# Altium schematic sheet DigitalIO.SchDoc: xcore.ai Multi Channel Audio
size 408 x 287 mm; DocumentNumber: 5; Revision: 1V1; SheetNumber: 5; SheetTotal: 8
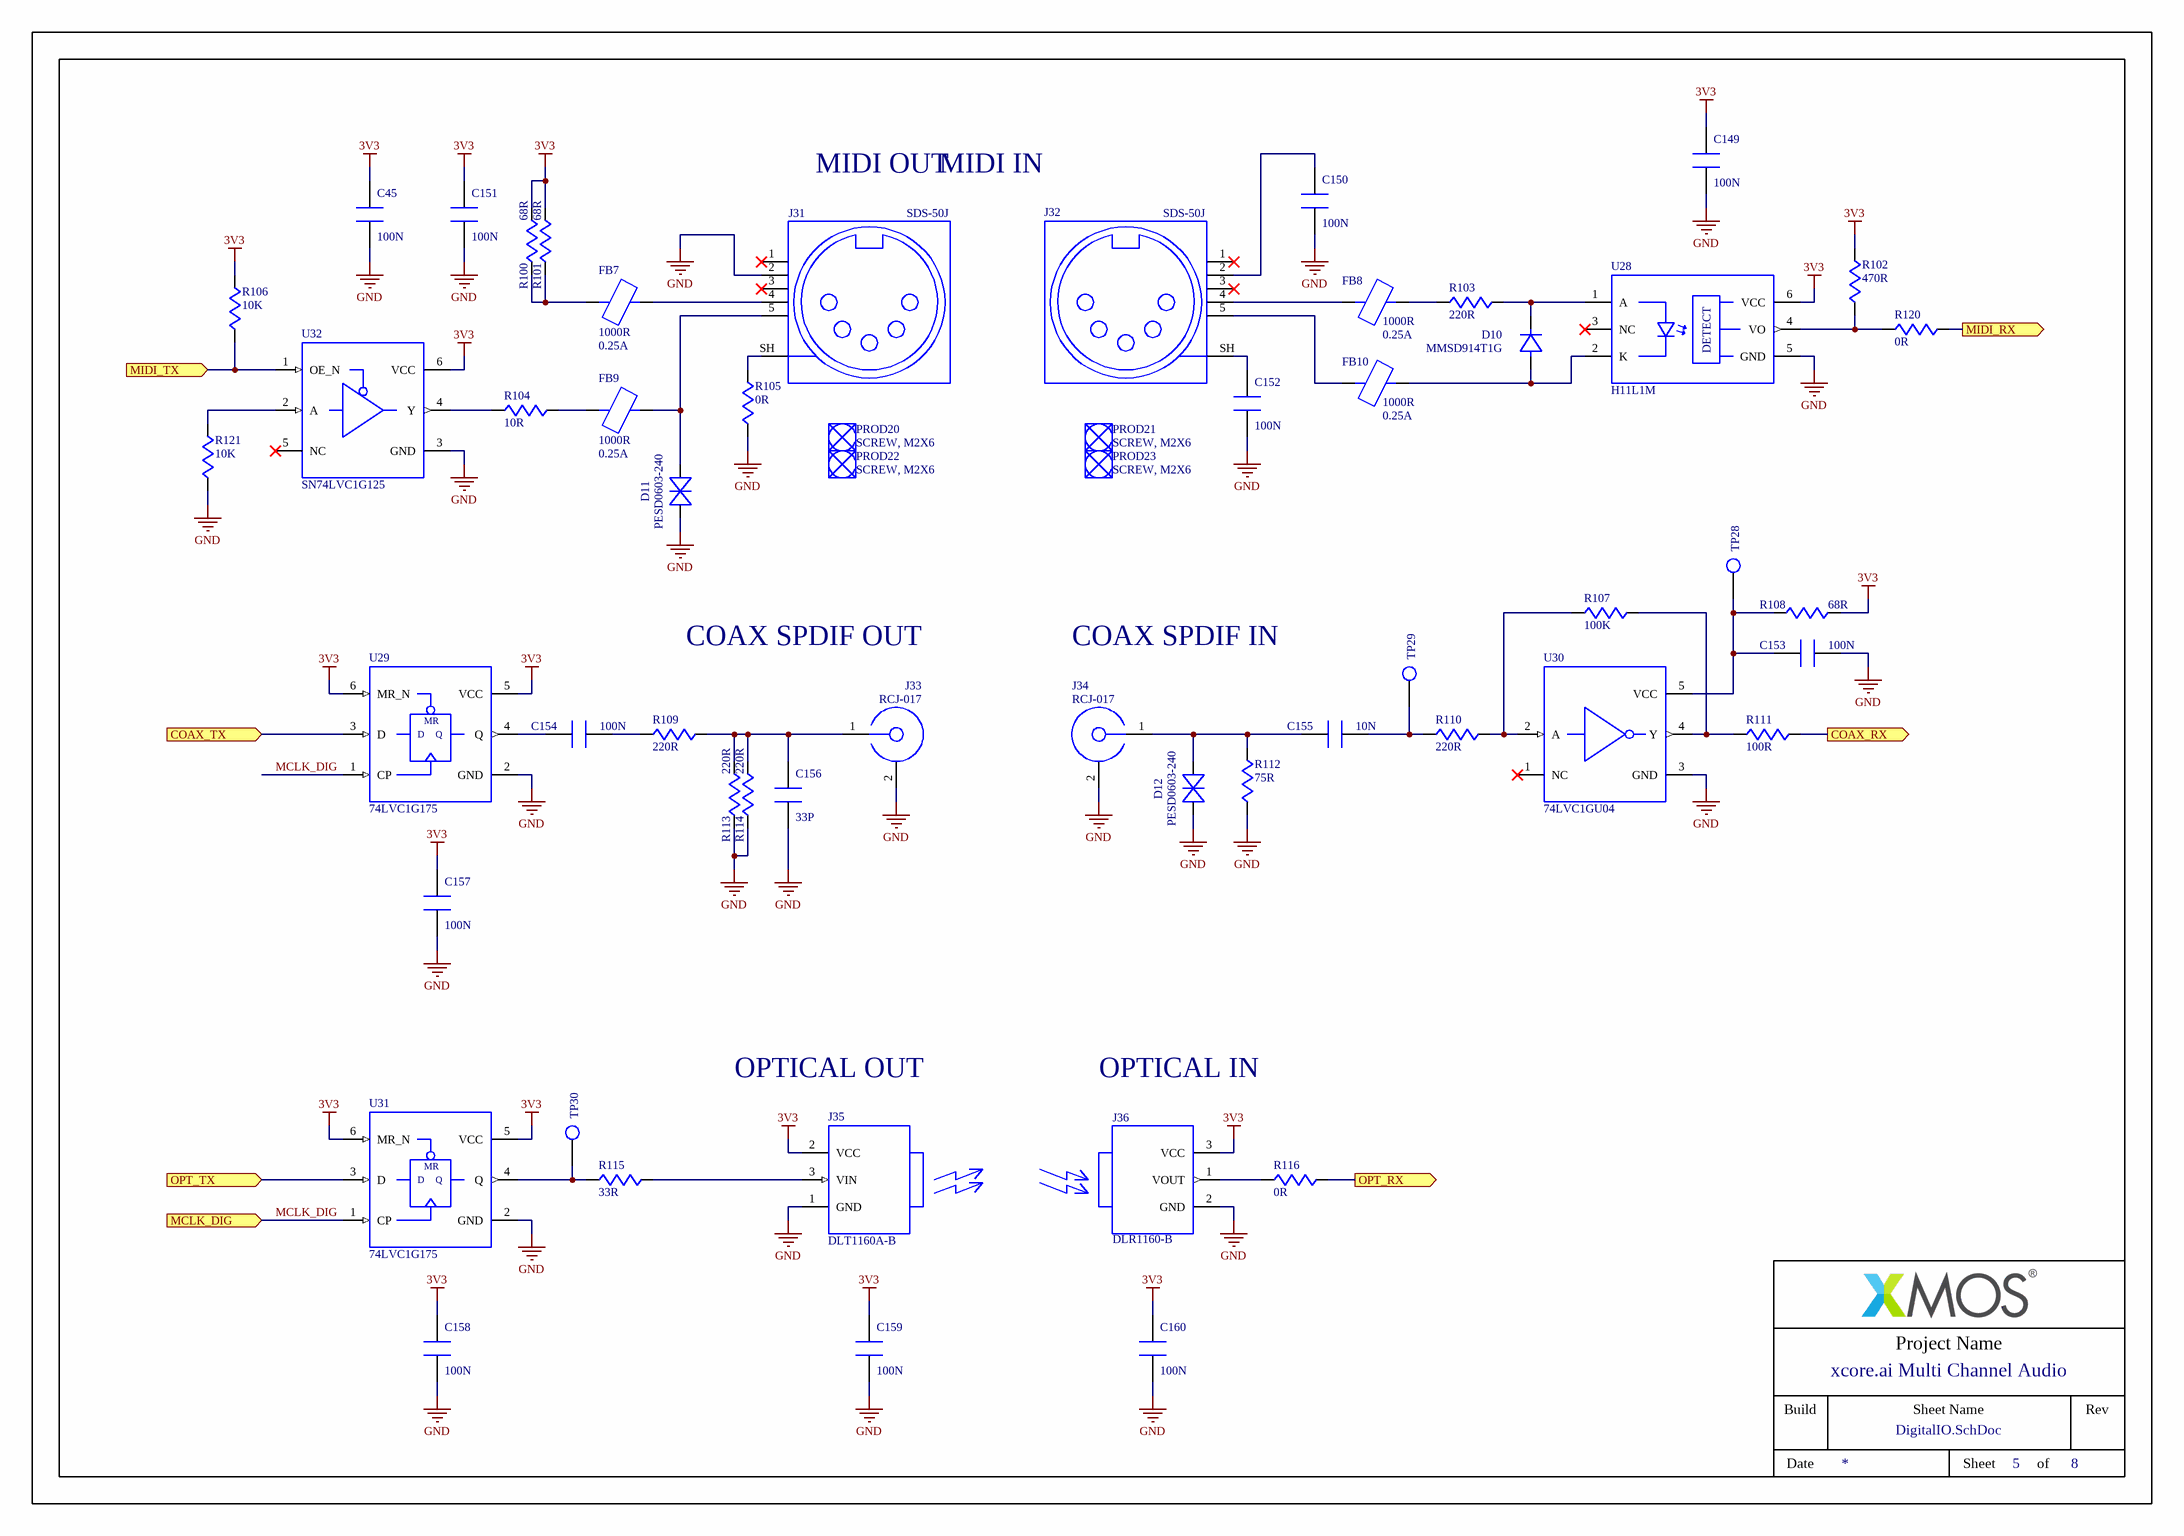
[diagram p0: DigitalIO.SchDoc]

## Parts
C45  100N  [CAPC1005X55N]
C149  100N  [CAPC1005X55N]
C150  100N  [CAPC1608X90N]
C151  100N  [CAPC1005X55N]
C152  100N  [CAPC1608X90N]
C153  100N  [CAPC1005X55N]
C154  100N  [CAPC1005X55N]
C155  10N  [CAPC1005X55N]
C156  33P  [CAPC1005X55N]
C157  100N  [CAPC1005X55N]
C158  100N  [CAPC1005X55N]
C159  100N  [CAPC1005X55N]
C160  100N  [CAPC1005X55N]
D10  MMSD914T1G  [SOD3716X135N]
D11  PESD0603-240  [RESC1608X55N]
D12  PESD0603-240  [RESC1608X55N]
FB7  1000R  Rated Current: 0.25A  [INDC1005X55N]
FB8  1000R  Rated Current: 0.25A  [INDC1005X55N]
FB9  1000R  Rated Current: 0.25A  [INDC1005X55N]
FB10  1000R  Rated Current: 0.25A  [INDC1005X55N]
J31  SDS-50J  [DIN_5PIN_180_RA]
J32  SDS-50J  [DIN_5PIN_180_RA]
J33  RCJ-017  [CON_CUI_RCJ_017]
J34  RCJ-017  [CON_CUI_RCJ_017]
J35  DLT1160A-B  [CON_OPT_AIXIN_DLX1160]
J36  DLR1160-B  [CON_OPT_AIXIN_DLX1160]
PROD20  SCREW, M2X6  (mechanical)
PROD21  SCREW, M2X6  (mechanical)
PROD22  SCREW, M2X6  (mechanical)
PROD23  SCREW, M2X6  (mechanical)
R100  68R  [RESC3116X65N]
R101  68R  [RESC3116X65N]
R102  470R  [RESC1608X55N]
R103  220R  [RESC3116X65N]
R104  10R  [RESC3116X65N]
R105  0R  [RESC1608X55N]
R106  10K  [RESC1608X55N]
R107  100K  [RESC1608X55N]
R108  68R  [RESC1608X55N]
R109  220R  [RESC1608X55N]
R110  220R  [RESC1608X55N]
R111  100R  [RESC1608X55N]
R112  75R  [RESC3116X65N]
R113  220R  [RESC1608X55N]
R114  220R  [RESC1608X55N]
R115  33R  [RESC1608X55N]
R116  0R  [RESC1608X55N]
R120  0R  [RESC1608X55N]
R121  10K  [RESC1608X55N]
TP28  TESTPOINT  [TESTPOINT_SMD_1MM]  (value not drawn)  (no BOM)
TP29  TESTPOINT  [TESTPOINT_SMD_1MM]  (value not drawn)  (no BOM)
TP30  TESTPOINT  [TESTPOINT_SMD_1MM]  (value not drawn)  (no BOM)
U28  H11L1M  [IC_ONSEMI_PDIP6_646BY]
U29  74LVC1G175  [SOT95P280X145-6N]
U30  74LVC1GU04  [SOT23-5P95_275X110L40X37N]
U31  74LVC1G175  [SOT95P280X145-6N]
U32  SN74LVC1G125  [TI_R_PUSON_N6]

## Ports
COAX_RX (out), COAX_TX (in), MCLK_DIG (in), MIDI_RX (out), MIDI_TX (in), OPT_RX (out), OPT_TX (in)

## Nets
3V3: C45.1 C149.1 C151.1 C157.1 C158.1 C159.1 C160.1 J35.2(VCC) J36.3(VCC) R100.2 R101.2 R102.2 R106.2 R108.1 U28.6(VCC) U29.5(VCC) U29.6(MR_N) U31.5(VCC) U31.6(MR_N) U32.6(VCC)
GND: C45.2 C149.2 C150.2 C151.2 C152.2 C153.2 C156.2 C157.2 C158.2 C159.2 C160.2 D11.1 D12.1 J31.2 J33.2 J34.2 J35.1(GND) J36.2(GND) R105.1 R112.1 R113.1 R114.1 R121.1 U28.5(GND) U29.2(GND) U30.3(GND) U31.2(GND) U32.3(GND)
COAX_RX: R111.2 ; port COAX_RX
COAX_TX: U29.3(D) ; port COAX_TX
MCLK_DIG: U29.1(CP) U31.1(CP) ; port MCLK_DIG
MIDI_RX: R120.2 ; port MIDI_RX
MIDI_TX: R106.1 U32.1(OE_N) ; port MIDI_TX
OPT_RX: R116.2 ; port OPT_RX
OPT_TX: U31.3(D) ; port OPT_TX
NetC150_1: C150.1 J32.2
NetC152_1: C152.1 J32.SH(SHIELD)
NetC153_1: C153.1 R108.2 TP28.1 U30.5(VCC)
NetC154_1: C154.1 U29.4(Q)
NetC154_2: C154.2 R109.1
NetC155_1: C155.1 D12.2 J34.1 R112.2
NetC155_2: C155.2 R110.1 TP29.1
NetC156_1: C156.1 J33.1 R109.2 R113.2 R114.2
NetD10_1: D10.1(K) R103.2 U28.1(A)
NetD10_2: D10.2(A) FB10.2 U28.2(K)
NetD11_2: D11.2 FB9.1 J31.5
NetFB7_1: FB7.1 J31.4
NetFB7_2: FB7.2 R100.1 R101.1
NetFB8_1: FB8.1 J32.4
NetFB8_2: FB8.2 R103.1
NetFB9_2: FB9.2 R104.2
NetFB10_1: FB10.1 J32.5
NetJ31_SH: J31.SH(SHIELD) R105.2
NetJ35_3: J35.3(VIN) R115.2
NetJ36_1: J36.1(VOUT) R116.1
NetR102_1: R102.1 R120.1 U28.4(VO)
NetR104_1: R104.1 U32.4(Y)
NetR107_1: R107.1 R110.2 U30.2(A)
NetR107_2: R107.2 R111.1 U30.4(Y)
NetR115_1: R115.1 TP30.1 U31.4(Q)
NetR121_2: R121.2 U32.2(A)

Not connected (* = marked no-connect by the designer): J31 1* 3*; J32 1* 3*; U28 3(NC)*; U30 1(NC)*; U32 5(NC)*

## Notes on the sheet
- MIDI OUT
- MIDI IN
- COAX SPDIF OUT
- COAX SPDIF IN
- OPTICAL OUT
- OPTICAL IN
- Project Name
- Build
- Sheet Name
- Rev
- Date
- Sheet
- of
- (in symbol GEN-11-0051) MR
- (in symbol GEN-13-0028) DETECT

## Library data of the parts
C45 C149 C151 C153 C154 C157-C160 = STD-06-0048: CHIP CAPACITOR, CERAMIC, 100NF, 16V, 10%, X7R, 0402; Manufacturer: Yageo; Manufacturer Part Number: CC0402KRX7R7BB104; Approx Volume Cost ($): 0.003; VALUE: 100N; Part Number: STD-06-0048; Dielectric: X7R; Rated Voltage: 16V; Tolerance: 10%; Web Search Link: http://www.google.com/search?q=CC0402KRX7R7BB104
C150 C152 = STD-06-0073: CHIP CAPACITOR, CERAMIC, 100NF, 50V, 10%, X7R, 0603; Manufacturer: Yageo; Manufacturer Part Number: CC0603KRX7R9BB104; Approx Volume Cost ($): 0.002; VALUE: 100N; Part Number: STD-06-0073; Dielectric: X7R; Rated Voltage: 50V; Tolerance: 10%; Web Search Link: http://www.google.com/search?q=CC0603KRX7R9BB104
C155 = STD-06-0042: CHIP CAPACITOR, CERAMIC, 10NF, 50V, 10%, X7R, 0402; Manufacturer: Yageo; Manufacturer Part Number: CC0402KRX7R9BB103; Approx Volume Cost ($): 0.002; VALUE: 10N; Part Number: STD-06-0042; Dielectric: X7R; Rated Voltage: 50V; Tolerance: 10%; Web Search Link: http://www.google.com/search?q=CC0402KRX7R9BB103
C156 = STD-06-0019: CHIP CAPACITOR, CERAMIC, 33PF, 50V, 5%, NP0, 0402; Manufacturer: Yageo; Manufacturer Part Number: CC0402JRNPO9BN330; Approx Volume Cost ($): 0.003; VALUE: 33P; Part Number: STD-06-0019; Dielectric: NP0; Rated Voltage: 50V; Tolerance: 5%; Web Search Link: http://www.google.com/search?q=CC0402JRNPO9BN330
D10 = GEN-16-0055: Diode, 100V, 0.2A, SOD123; Manufacturer: ON Semiconductor; Approx Volume Cost ($): 0.04; VALUE: MMSD914T1G; Part Number: GEN-16-0055; Manufacturer Part Number: MMSD914T1G; Web Search Link: http://www.google.com/search?q=MMSD914T1G
D11 D12 = GEN-16-0011: Polymer ESD Protection Device, 24V Stand-Off, 0.25pF, 0603; Manufacturer: Tyco; Approx Volume Cost ($): 0.12; VALUE: PESD0603-240; Part Number: GEN-16-0011; Manufacturer Part Number: PESD0603-240; Web Search Link: http://www.google.com/search?q=PESD0603-240
FB7-FB10 = GEN-04-0019: Ferrite Bead, 1000R AT 100MHz, For Signal Lines, 0402, 0.25A; Manufacturer: Murata; Manufacturer Part Number: BLM15HD102SN1; Max DCR: 1.25R; Approx Volume Cost ($): 0.018; VALUE: 1000R; Part Number: GEN-04-0019; Web Search Link: http://www.google.com/search?q=BLM15HD102SN1
J31 J32 = GEN-01-0123: Standard DIN Connector, 5 Pin, 180 degrees, PCB Mount, Right Angle, Through Hole; Manufacturer: CUI; Approx Volume Cost ($): 0.78; VALUE: SDS-50J; Part Number: GEN-01-0123; Manufacturer Part Number: SDS-50J; Web Search Link: http://www.google.com/search?q=SDS-50J
J33 J34 = GEN-01-0124: RCA Jack, Right Angle, Orange, Through Hole; Manufacturer: CUI; Approx Volume Cost ($): 0.47; VALUE: RCJ-017; Part Number: GEN-01-0124; Manufacturer Part Number: RCJ-017; Web Search Link: http://www.google.com/search?q=RCJ-017
J35 = GEN-01-0119: Optical Digital Audio Transmitter, Black Shutter, 16Mbps max, 2.7-5.5V, Through Hole; Manufacturer: Aixin Opto-Electrical Technology; Approx Volume Cost ($): 0.5; VALUE: DLT1160A-B; Part Number: GEN-01-0119; Manufacturer Part Number: DLT1160A-B; Web Search Link: http://www.google.com/search?q=DLT1160A
J36 = GEN-01-0120: Optical Digital Audio Receiver, Black Shutter, 16Mbps max, 2.7-5.5V, Through Hole; Manufacturer: Aixin Opto-Electrical Technology; Approx Volume Cost ($): 0.5; VALUE: DLR1160-B; Part Number: GEN-01-0120; Manufacturer Part Number: DLR1160-B; Web Search Link: http://www.google.com/search?q=DLR1160
PROD20-PROD23 = GEN-23-0012: Machine screw, M2 thread, 6mm length, Steel, BZP, Pan head Pozidriv; Manufacturer: TR Fastenings; Manufacturer Part Number: M2 6 PRSTMC Z100; Approx Volume Cost ($): 0.03; VALUE: SCREW, M2X6; Part Number: GEN-23-0012; Web Search Link: http://www.google.com/search?q=M2 6 PRSTMC Z100
R100 R101 = STD-05-0034: CHIP RESISTOR, 68 OHM, 0.25W, 1%, 1206; Manufacturer: Yageo; Manufacturer Part Number: RC1206FR-0768RL; Max Voltage: 200V; Max Power: 250mW; Temperature Coefficient: ±100ppm/°C; Approx Volume Cost ($): 0.004; VALUE: 68R; Part Number: STD-05-0034; Tolerance: 1%; Web Search Link: http://www.google.com/search?q=RC1206FR-0768RL
R102 = STD-02-0054: CHIP RESISTOR, 470 OHM, 0.1W, 1%, 0603; Manufacturer: Yageo; Manufacturer Part Number: RC0603FR-07470RL; Max Voltage: 50V; Max Power: 100mW; Temperature Coefficient: ±100ppm/°C; Approx Volume Cost ($): 0.002; VALUE: 470R; Part Number: STD-02-0054; Tolerance: 1%; Web Search Link: http://www.google.com/search?q=RC0603FR-07470RL
R103 = STD-05-0046: CHIP RESISTOR, 220 OHM, 0.25W, 1%, 1206; Manufacturer: Yageo; Manufacturer Part Number: RC1206FR-07220RL; Max Voltage: 200V; Max Power: 250mW; Temperature Coefficient: ±100ppm/°C; Approx Volume Cost ($): 0.004; VALUE: 220R; Part Number: STD-05-0046; Tolerance: 1%; Web Search Link: http://www.google.com/search?q=RC1206FR-07220RL
R104 = STD-05-0014: CHIP RESISTOR, 10 OHM, 0.25W, 1%, 1206; Manufacturer: Yageo; Manufacturer Part Number: RC1206FR-0710RL; Max Voltage: 200V; Max Power: 250mW; Temperature Coefficient: ±200ppm/°C; Approx Volume Cost ($): 0.004; VALUE: 10R; Part Number: STD-05-0014; Tolerance: 1%; Web Search Link: http://www.google.com/search?q=RC1206FR-0710RL
R105 R116 R120 = STD-02-0001: CHIP RESISTOR, ZERO OHM JUMPER, 1A, 0603; Manufacturer: Yageo; Manufacturer Part Number: RC0603JR-070RL; Tolerance: NA; Max Voltage: 50V; Approx Volume Cost ($): 0.002; VALUE: 0R; Part Number: STD-02-0001; Max Power: NA; Temperature Coefficient: NA; Web Search Link: http://www.google.com/search?q=RC0603JR-070RL
R106 R121 = STD-02-0086: CHIP RESISTOR, 10K OHM, 0.1W, 1%, 0603; Manufacturer: Yageo; Manufacturer Part Number: RC0603FR-0710KL; Max Voltage: 50V; Max Power: 100mW; Temperature Coefficient: ±100ppm/°C; Approx Volume Cost ($): 0.002; VALUE: 10K; Part Number: STD-02-0086; Tolerance: 1%; Web Search Link: http://www.google.com/search?q=RC0603FR-0710KL
R107 = STD-02-0110: CHIP RESISTOR, 100K OHM, 0.1W, 1%, 0603; Manufacturer: Yageo; Manufacturer Part Number: RC0603FR-07100KL; Max Voltage: 50V; Max Power: 100mW; Temperature Coefficient: ±100ppm/°C; Approx Volume Cost ($): 0.002; VALUE: 100K; Part Number: STD-02-0110; Tolerance: 1%; Web Search Link: http://www.google.com/search?q=RC0603FR-07100KL
R108 = STD-02-0034: CHIP RESISTOR, 68 OHM, 0.1W, 1%, 0603; Manufacturer: Yageo; Manufacturer Part Number: RC0603FR-0768RL; Max Voltage: 50V; Max Power: 100mW; Temperature Coefficient: ±100ppm/°C; Approx Volume Cost ($): 0.002; VALUE: 68R; Part Number: STD-02-0034; Tolerance: 1%; Web Search Link: http://www.google.com/search?q=RC0603FR-0768RL
R109 R110 R113 R114 = STD-02-0046: CHIP RESISTOR, 220 OHM, 0.1W, 1%, 0603; Manufacturer: Yageo; Manufacturer Part Number: RC0603FR-07220RL; Max Voltage: 50V; Max Power: 100mW; Temperature Coefficient: ±100ppm/°C; Approx Volume Cost ($): 0.002; VALUE: 220R; Part Number: STD-02-0046; Tolerance: 1%; Web Search Link: http://www.google.com/search?q=RC0603FR-07220RL
R111 = STD-02-0038: CHIP RESISTOR, 100 OHM, 0.1W, 1%, 0603; Manufacturer: Yageo; Manufacturer Part Number: RC0603FR-07100RL; Max Voltage: 50V; Max Power: 100mW; Temperature Coefficient: ±100ppm/°C; Approx Volume Cost ($): 0.002; VALUE: 100R; Part Number: STD-02-0038; Tolerance: 1%; Web Search Link: http://www.google.com/search?q=RC0603FR-07100RL
R112 = STD-05-0035: CHIP RESISTOR, 75 OHM, 0.25W, 1%, 1206; Manufacturer: Yageo; Manufacturer Part Number: RC1206FR-0775RL; Max Voltage: 200V; Max Power: 250mW; Temperature Coefficient: ±100ppm/°C; Approx Volume Cost ($): 0.004; VALUE: 75R; Part Number: STD-05-0035; Tolerance: 1%; Web Search Link: http://www.google.com/search?q=RC1206FR-0775RL
R115 = STD-02-0026: CHIP RESISTOR, 33 OHM, 0.1W, 1%, 0603; Manufacturer: Yageo; Manufacturer Part Number: RC0603FR-0733RL; Max Voltage: 50V; Max Power: 100mW; Temperature Coefficient: ±100ppm/°C; Approx Volume Cost ($): 0.002; VALUE: 33R; Part Number: STD-02-0026; Tolerance: 1%; Web Search Link: http://www.google.com/search?q=RC0603FR-0733RL
TP28-TP30 = GEN-24-0003: Testpoint, SMD, 1mm; Manufacturer: NA; VALUE: TESTPOINT; Part Number: GEN-24-0003; Manufacturer Part Number: NA; Approx Volume Cost ($): NA
U28 = GEN-13-0028: Optocoupler, Schmitt Trigger Output, 3-15V, 1.6mA Turn-On, PDIP6_SMD; Manufacturer: ON Semiconductor; Manufacturer Part Number: H11L1SM; Approx Volume Cost ($): 0.3; VALUE: H11L1M; Part Number: GEN-13-0028; Web Search Link: http://www.google.com/search?q=H11L1SM
U29 U31 = GEN-11-0051: Single D-Type Flip Flop with Reset, Positive Edge Trigger, LVC Series, SOT23-6 (SC-74); Manufacturer: Nexperia; Manufacturer Part Number: 74LVC1G175GV; Approx Volume Cost ($): 0.1; VALUE: 74LVC1G175; Part Number: GEN-11-0051; Web Search Link: http://www.google.com/search?q=74LVC1G175GV
U30 = GEN-11-0047: Single Unbuffered Inverter, LVC Series, SOT23-5; Manufacturer: Nexperia; Manufacturer Part Number: 74LVC1GU04GV; Approx Volume Cost ($): 0.06; VALUE: 74LVC1GU04; Part Number: GEN-11-0047; Web Search Link: http://www.google.com/search?q=74LVC1GU04GV
U32 = GEN-11-0049: Single Buffer with 3-State Output, LVC Series, SON6; Manufacturer: Texas Instruments; Manufacturer Part Number: SN74LVC1G125DRYR; Approx Volume Cost ($): 0.14; VALUE: SN74LVC1G125; Part Number: GEN-11-0049; Web Search Link: http://www.google.com/search?q=SN74LVC1G125DRYR